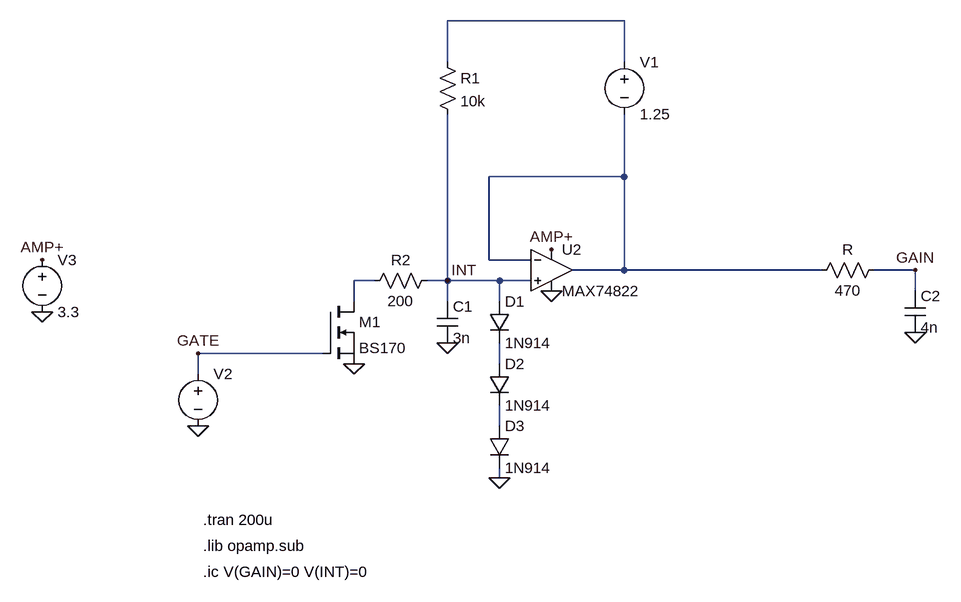
[diagram p0: schematic gain-ramp-summing.asc]
gain-ramp-summing.asc, the LTspice schematic file:
Version 4.1
SHEET 1 1620 688
WIRE 784 -176 512 -176
WIRE 512 -112 512 -176
WIRE 784 -112 784 -176
WIRE 784 64 784 -32
WIRE 784 64 576 64
WIRE 576 192 576 64
WIRE 640 192 576 192
WIRE 784 208 784 64
WIRE 784 208 704 208
WIRE 1088 208 784 208
WIRE 1232 208 1168 208
WIRE 400 224 368 224
WIRE 512 224 512 -32
WIRE 512 224 480 224
WIRE 592 224 512 224
WIRE 640 224 592 224
WIRE 1232 240 1232 208
WIRE 368 256 368 224
WIRE 512 256 512 224
WIRE 592 256 592 224
WIRE 320 336 128 336
WIRE 592 352 592 320
WIRE 128 368 128 336
WIRE 592 448 592 416
WIRE 592 528 592 512
FLAG 512 320 0
FLAG 1232 304 0
FLAG 1232 208 GAIN
FLAG 512 224 INT
FLAG 368 352 0
FLAG 128 448 0
FLAG 128 336 GATE
FLAG 592 528 0
FLAG 672 240 0
FLAG -112 272 0
FLAG -112 192 AMP+
FLAG 672 176 AMP+
SYMBOL cap 496 256 R0
SYMATTR InstName C1
SYMATTR Value 3n
SYMBOL cap 1216 240 R0
SYMATTR InstName C2
SYMATTR Value 4n
SYMBOL voltage 784 -128 R0
WINDOW 123 0 0 Left 0
WINDOW 39 0 0 Left 0
SYMATTR InstName V1
SYMATTR Value 1.25
SYMBOL res 496 -128 R0
SYMATTR InstName R1
SYMATTR Value 10k
SYMBOL nmos 320 256 R0
SYMATTR InstName M1
SYMATTR Value BS170
SYMBOL voltage 128 352 R0
WINDOW 3 24 96 Invisible 2
WINDOW 123 0 0 Left 0
WINDOW 39 0 0 Left 0
SYMATTR Value PULSE(3.3 0 5u 100n 100n 50u 100u 100)
SYMATTR InstName V2
SYMBOL res 496 208 R90
WINDOW 0 0 56 VBottom 2
WINDOW 3 32 56 VTop 2
SYMATTR InstName R2
SYMATTR Value 200
SYMBOL diode 576 256 R0
SYMATTR InstName D1
SYMATTR Value 1N914
SYMBOL diode 576 352 R0
SYMATTR InstName D2
SYMATTR Value 1N914
SYMBOL diode 576 448 R0
SYMATTR InstName D3
SYMATTR Value 1N914
SYMBOL voltage -112 176 R0
WINDOW 123 0 0 Left 0
WINDOW 39 0 0 Left 0
SYMATTR InstName V3
SYMATTR Value 3.3
SYMBOL res 1184 192 R90
WINDOW 0 0 56 VBottom 2
WINDOW 3 32 56 VTop 2
SYMATTR InstName R
SYMATTR Value 470
SYMBOL OpAmps\\MAX74822 672 144 R0
SYMATTR InstName U2
TEXT 136 592 Left 2 !.tran 200u
TEXT 136 632 Left 2 !.lib opamp.sub
TEXT 136 672 Left 2 !.ic V(GAIN)=0 V(INT)=0

The netlist it stands for:
* gain-ramp-summing.asc
C1 INT 0 3n
C2 GAIN 0 4n
V1 N001 N002 1.25
R1 N001 INT 10k
M1 N003 GATE 0 0 BS170
V2 GATE 0 PULSE(3.3 0 5u 100n 100n 50u 100u 100)
R2 INT N003 200
D1 INT N004 1N914
D2 N004 N005 1N914
D3 N005 0 1N914
V3 AMP+ 0 3.3
R GAIN N002 470
X§U2 INT N002 AMP+ 0 N002 MAX74822  ; pins In+ In- V+ V- OUT
.model D D
.lib standard.dio
.model NMOS NMOS
.model PMOS PMOS
.lib standard.mos
.tran 200u
.lib opamp.sub
.ic V(GAIN)=0 V(INT)=0
.backanno
.end